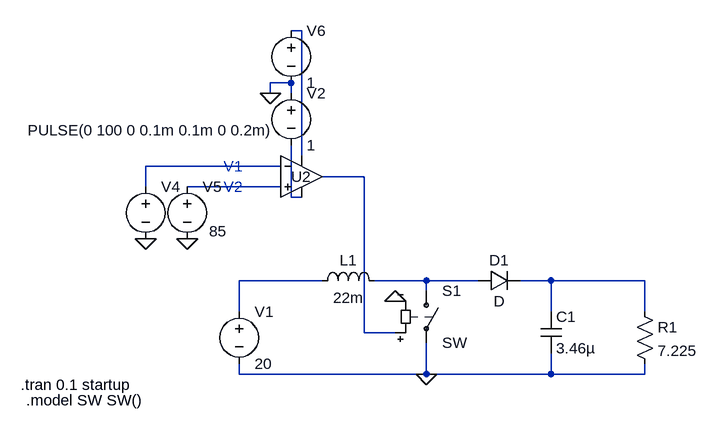
[diagram p0: schematic Boostconverter.asc]
Boostconverter.asc, the LTspice schematic file:
Version 4
SHEET 1 1428 680
WIRE -64 -304 -80 -304
WIRE -80 -224 -112 -224
WIRE -112 -208 -112 -224
WIRE -80 -208 -80 -224
WIRE -64 -112 -64 -304
WIRE -96 -96 -304 -96
WIRE 32 -80 -32 -80
WIRE -304 -64 -304 -96
WIRE -96 -64 -240 -64
WIRE -80 -48 -80 -128
WIRE -64 -48 -80 -48
WIRE -32 80 -160 80
WIRE 128 80 48 80
WIRE 208 80 128 80
WIRE 320 80 272 80
WIRE 464 80 320 80
WIRE 128 96 128 80
WIRE -160 128 -160 80
WIRE 320 128 320 80
WIRE 464 128 464 80
WIRE 32 160 32 -80
WIRE 80 160 32 160
WIRE -160 224 -160 208
WIRE 128 224 128 176
WIRE 128 224 -160 224
WIRE 320 224 320 192
WIRE 320 224 128 224
WIRE 464 224 464 208
WIRE 464 224 320 224
FLAG -304 16 0
FLAG -240 16 0
FLAG 80 112 0
FLAG -112 -208 0
FLAG 128 224 0
SYMBOL voltage -160 112 R0
WINDOW 123 0 0 Left 2
WINDOW 39 0 0 Left 2
SYMATTR InstName V1
SYMATTR Value 20
SYMBOL res 448 112 R0
SYMATTR InstName R1
SYMATTR Value 7.225
SYMBOL cap 304 128 R0
SYMATTR InstName C1
SYMATTR Value 3.46µ
SYMBOL ind -48 96 R270
WINDOW 0 32 56 VTop 2
WINDOW 3 5 56 VBottom 2
SYMATTR InstName L1
SYMATTR Value 22m
SYMBOL diode 208 96 R270
WINDOW 0 32 32 VTop 2
WINDOW 3 0 32 VBottom 2
SYMATTR InstName D1
SYMBOL sw 128 80 R0
SYMATTR InstName S1
SYMBOL Opamps\\UniversalOpamp2 -64 -80 R0
WINDOW 0 -16 0 Left 2
SYMATTR InstName U2
SYMBOL voltage -304 -80 R0
WINDOW 3 -181 -71 Left 2
WINDOW 123 0 0 Left 2
WINDOW 39 0 0 Left 2
SYMATTR Value PULSE(0 100 0 0.1m 0.1m 0 0.2m)
SYMATTR InstName V4
SYMBOL voltage -240 -80 R0
WINDOW 123 0 0 Left 2
WINDOW 39 0 0 Left 2
WINDOW 3 34 84 Left 2
SYMATTR Value 85
SYMATTR InstName V5
SYMBOL voltage -80 -320 R0
WINDOW 123 0 0 Left 2
WINDOW 39 0 0 Left 2
SYMATTR InstName V6
SYMATTR Value 1
SYMBOL voltage -80 -224 R0
WINDOW 123 0 0 Left 2
WINDOW 39 0 0 Left 2
SYMATTR InstName V2
SYMATTR Value 1
TEXT -184 -96 Left 2 ;V1
TEXT -184 -64 Left 2 ;V2
TEXT -496 240 Left 2 !.tran 0.1 startup
TEXT -488 264 Left 2 !.model SW SW()

The netlist it stands for:
* Boostconverter.asc
V1 N006 0 20
R1 N008 0 7.225
C1 N008 0 3.46µ
L1 N006 N007 22m
D1 N007 N008 D
S1 N007 0 N003 0 SW
XU2 N004 N002 N001 N005 N003 level.2 Avol=1Meg GBW=10Meg Slew=10Meg ilimit=25m rail=0 Vos=0 phimargin=45 en=0 enk=0 in=0 ink=0 Rin=500Meg  ; pins IN+ IN- V+ V- OUT
V4 N002 0 PULSE(0 100 0 0.1m 0.1m 0 0.2m)
V5 N004 0 85
V6 N001 0 1
V2 0 N005 1
.model D D
.lib standard.dio
* V1
* V2
.tran 0.1 startup
.model SW SW()
.lib UniversalOpamps2.sub
.backanno
.end